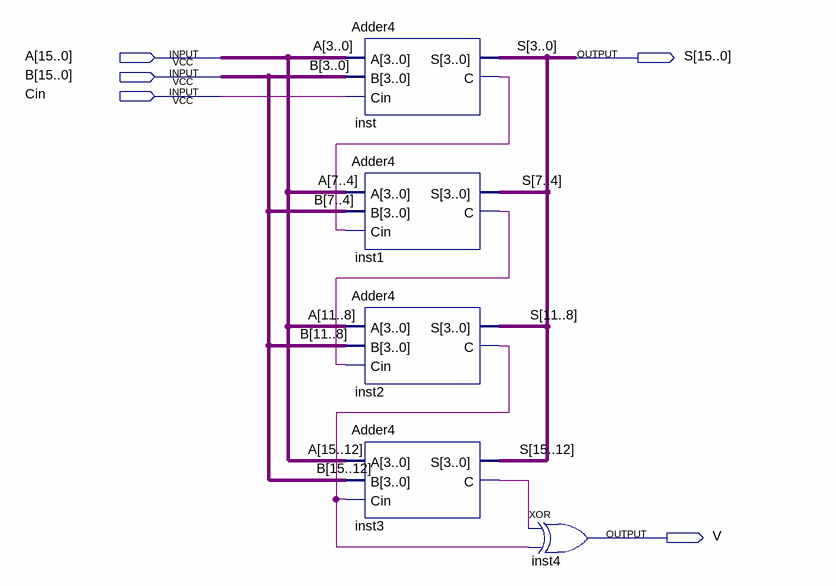
[diagram p0: schematic sheet]
// Quartus schematic Adder16.bdf as structural Verilog: 5 symbols, 5 pins
module Adder16 (
  input  [15:0] A,
  input  [15:0] B,
  input  Cin,
  output [15:0] S,
  output V
);

  wire inst1_c, inst2_c, inst3_c, inst_c;

  Adder4 inst (.A(A[3:0]), .B(B[3:0]), .Cin(Cin), .S(S[3:0]), .C(inst_c));
  Adder4 inst1 (.A(A[7:4]), .B(B[7:4]), .Cin(inst_c), .S(S[7:4]), .C(inst1_c));
  Adder4 inst2 (.A(A[11:8]), .B(B[11:8]), .Cin(inst1_c), .S(S[11:8]), .C(inst2_c));
  Adder4 inst3 (.A(A[15:12]), .B(B[15:12]), .Cin(inst2_c), .S(S[15:12]), .C(inst3_c));
  xor inst4 (V, inst3_c, inst2_c);
endmodule
